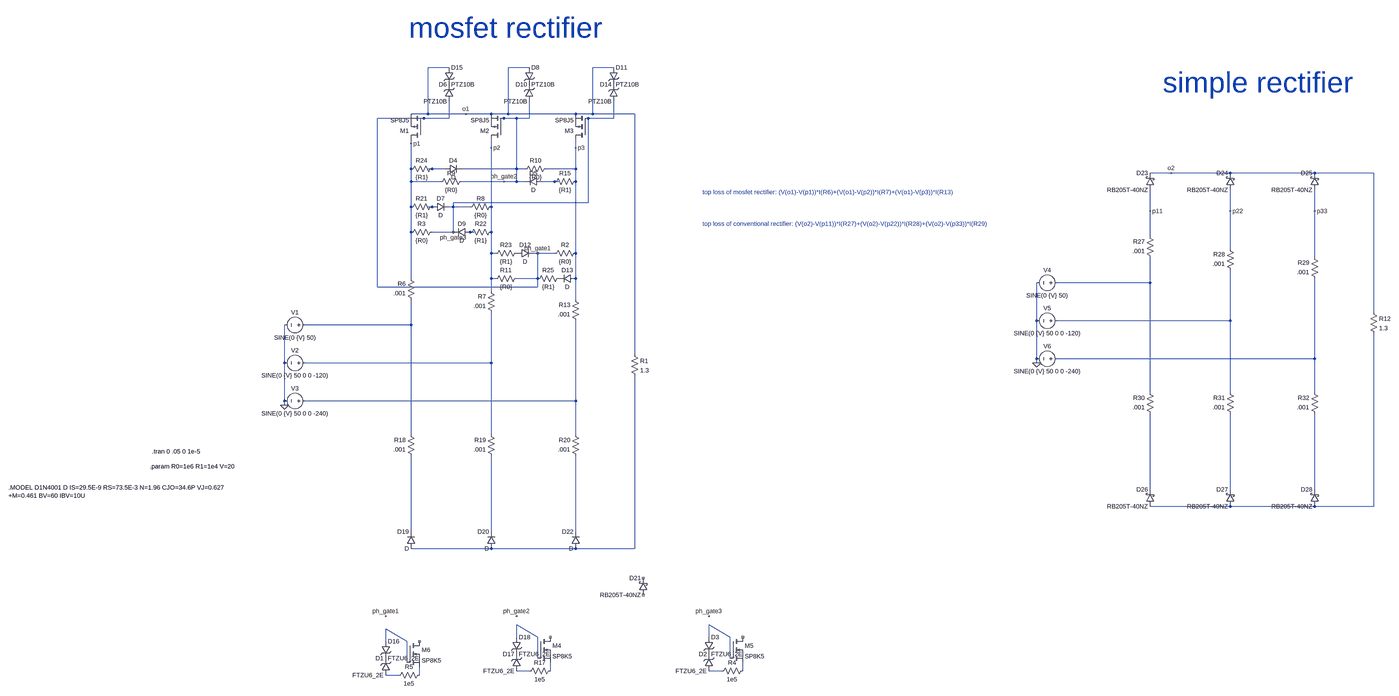
[diagram p0: schematic Draft1.asc, whole sheet]
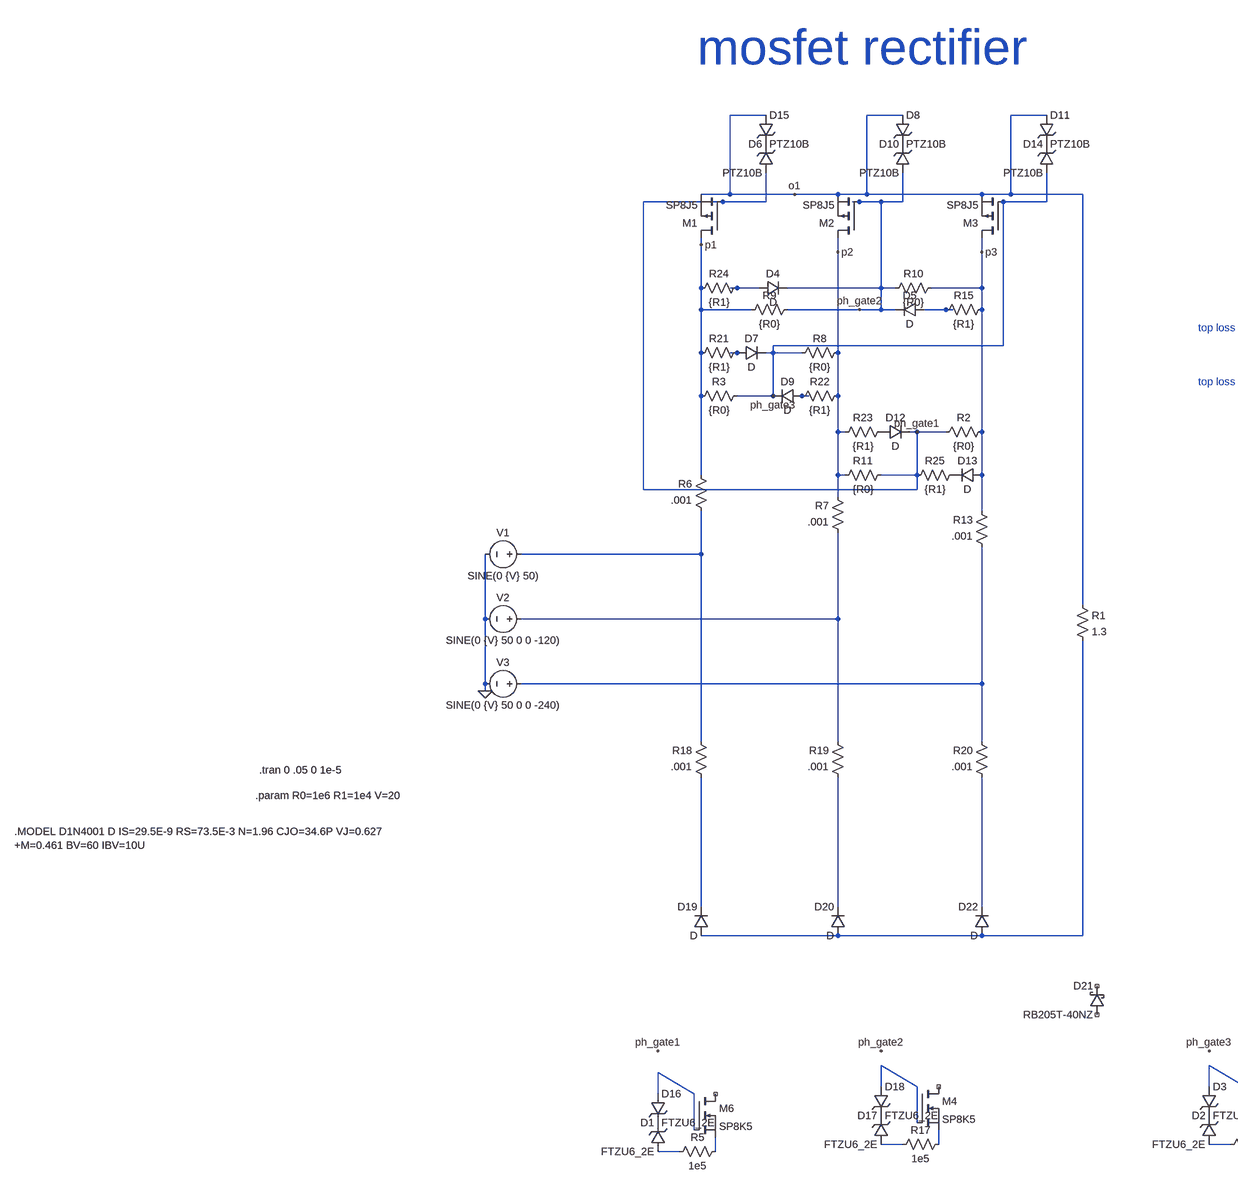
[diagram p1: schematic Draft1.asc, part, row 1 of 1, column 1 of 2]
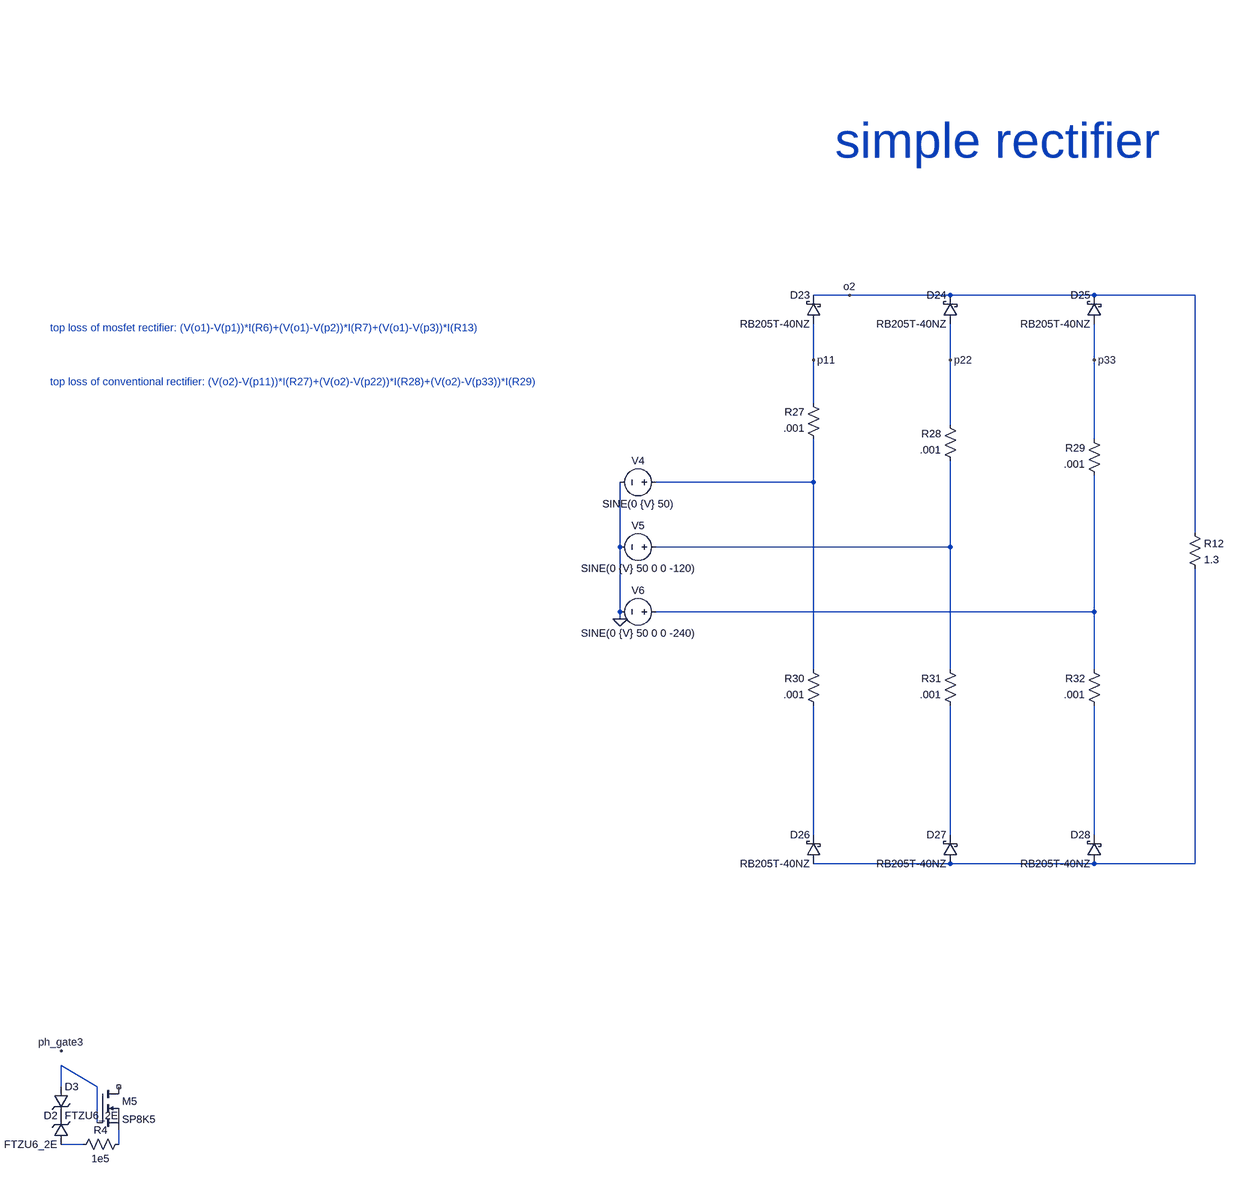
[diagram p2: schematic Draft1.asc, part, row 1 of 1, column 2 of 2]
Draft1.asc, the LTspice schematic file:
Version 4
SHEET 1 4840 1968
WIRE 608 -384 528 -384
WIRE 912 -384 832 -384
WIRE 1232 -384 1152 -384
WIRE 528 -208 528 -384
WIRE 528 -208 464 -208
WIRE 672 -208 528 -208
WIRE 768 -208 672 -208
WIRE 832 -208 832 -384
WIRE 832 -208 768 -208
WIRE 1088 -208 832 -208
WIRE 1152 -208 1152 -384
WIRE 1152 -208 1088 -208
WIRE 1312 -208 1152 -208
WIRE 512 -192 336 -192
WIRE 608 -192 608 -256
WIRE 608 -192 512 -192
WIRE 816 -192 800 -192
WIRE 864 -192 816 -192
WIRE 912 -192 912 -256
WIRE 912 -192 864 -192
WIRE 1232 -192 1232 -256
WIRE 1232 -192 1136 -192
WIRE 464 -96 464 -112
WIRE 768 -80 768 -112
WIRE 1088 -80 1088 -112
WIRE 464 0 464 -96
WIRE 544 0 528 0
WIRE 592 0 544 0
WIRE 864 0 864 -192
WIRE 864 0 656 0
WIRE 896 0 864 0
WIRE 1088 0 1088 -80
WIRE 1088 0 976 0
WIRE 3856 16 3776 16
WIRE 4080 16 3856 16
WIRE 4400 16 4080 16
WIRE 4624 16 4400 16
WIRE 464 48 464 0
WIRE 576 48 464 48
WIRE 816 48 656 48
WIRE 864 48 864 0
WIRE 864 48 816 48
WIRE 896 48 864 48
WIRE 1008 48 960 48
WIRE 1024 48 1008 48
WIRE 1088 48 1088 0
WIRE 1136 128 1136 -192
WIRE 1136 128 624 128
WIRE 464 144 464 48
WIRE 544 144 528 144
WIRE 624 144 624 128
WIRE 624 144 608 144
WIRE 688 144 624 144
WIRE 768 144 768 -80
WIRE 3776 160 3776 80
WIRE 4080 160 4080 80
WIRE 4400 160 4400 80
WIRE 464 240 464 144
WIRE 624 240 624 144
WIRE 624 240 544 240
WIRE 704 240 688 240
WIRE 768 240 768 144
WIRE 3776 256 3776 160
WIRE 4080 304 4080 160
WIRE 768 320 768 240
WIRE 784 320 768 320
WIRE 944 320 928 320
WIRE 1008 320 944 320
WIRE 1088 320 1088 48
WIRE 4400 336 4400 160
WIRE 464 416 464 240
WIRE 768 416 768 320
WIRE 784 416 768 416
WIRE 944 416 944 320
WIRE 944 416 864 416
WIRE 1088 416 1088 320
WIRE 3776 432 3776 336
WIRE 3776 432 3376 432
WIRE 336 448 336 -192
WIRE 944 448 944 416
WIRE 944 448 336 448
WIRE 768 464 768 416
WIRE 1088 496 1088 416
WIRE 4624 544 4624 16
WIRE 3296 576 3296 432
WIRE 4080 576 4080 384
WIRE 4080 576 3376 576
WIRE 464 592 464 496
WIRE 464 592 64 592
WIRE 1312 704 1312 -208
WIRE 3296 720 3296 576
WIRE 4400 720 4400 416
WIRE 4400 720 3376 720
WIRE -16 736 -16 592
WIRE 768 736 768 544
WIRE 768 736 64 736
WIRE 3296 736 3296 720
WIRE 3776 848 3776 432
WIRE 4080 848 4080 576
WIRE 4400 848 4400 720
WIRE -16 880 -16 736
WIRE 1088 880 1088 576
WIRE 1088 880 64 880
WIRE -16 896 -16 880
WIRE 464 1008 464 592
WIRE 768 1008 768 736
WIRE 1088 1008 1088 880
WIRE 3776 1216 3776 928
WIRE 4080 1216 4080 928
WIRE 4400 1216 4400 928
WIRE 4080 1280 3776 1280
WIRE 4400 1280 4080 1280
WIRE 4624 1280 4624 624
WIRE 4624 1280 4400 1280
WIRE 464 1376 464 1088
WIRE 768 1376 768 1088
WIRE 1088 1376 1088 1088
WIRE 768 1440 464 1440
WIRE 1088 1440 768 1440
WIRE 1312 1440 1312 784
WIRE 1312 1440 1088 1440
WIRE 864 1776 864 1728
WIRE 944 1776 864 1728
WIRE 1680 1776 1680 1728
WIRE 1760 1776 1680 1728
WIRE 368 1792 368 1744
WIRE 448 1792 368 1744
WIRE 944 1856 944 1776
WIRE 1760 1856 1760 1776
WIRE 448 1872 448 1792
WIRE 912 1904 864 1904
WIRE 992 1904 992 1872
WIRE 1728 1904 1680 1904
WIRE 1808 1904 1808 1872
WIRE 416 1920 368 1920
WIRE 496 1920 496 1888
FLAG -16 896 0
FLAG 864 1696 ph_gate2
FLAG 816 48 ph_gate2
FLAG 624 240 ph_gate3
FLAG 1680 1696 ph_gate3
FLAG 944 320 ph_gate1
FLAG 368 1696 ph_gate1
FLAG 3296 736 0
FLAG 672 -208 o1
FLAG 464 -96 p1
FLAG 768 -80 p2
FLAG 1088 -80 p3
FLAG 3856 16 o2
FLAG 3776 160 p11
FLAG 4080 160 p22
FLAG 4400 160 p33
SYMBOL voltage 80 592 R90
WINDOW 0 -32 56 VBottom 2
WINDOW 3 32 56 VTop 2
WINDOW 123 0 0 Left 0
WINDOW 39 0 0 Left 0
SYMATTR InstName V1
SYMATTR Value SINE(0 {V} 50)
SYMBOL voltage 80 736 R90
WINDOW 0 -32 56 VBottom 2
WINDOW 3 32 56 VTop 2
WINDOW 123 0 0 Left 0
WINDOW 39 0 0 Left 0
SYMATTR InstName V2
SYMATTR Value SINE(0 {V} 50 0 0 -120)
SYMBOL voltage 80 880 R90
WINDOW 0 -32 56 VBottom 2
WINDOW 3 32 56 VTop 2
WINDOW 123 0 0 Left 0
WINDOW 39 0 0 Left 0
SYMATTR InstName V3
SYMATTR Value SINE(0 {V} 50 0 0 -240)
SYMBOL pmos 512 -112 R180
SYMATTR InstName M1
SYMATTR Value SP8J5
SYMBOL res 1296 688 R0
SYMATTR InstName R1
SYMATTR Value 1.3
SYMBOL diode 592 16 R270
WINDOW 0 32 32 VTop 2
WINDOW 3 0 32 VBottom 2
SYMATTR InstName D4
SYMBOL diode 960 32 R90
WINDOW 0 0 32 VBottom 2
WINDOW 3 32 32 VTop 2
SYMATTR InstName D5
SYMBOL diode 544 160 R270
WINDOW 0 32 32 VTop 2
WINDOW 3 0 32 VBottom 2
SYMATTR InstName D7
SYMBOL diode 688 224 R90
WINDOW 0 0 32 VBottom 2
WINDOW 3 32 32 VTop 2
SYMATTR InstName D9
SYMBOL diode 864 336 R270
WINDOW 0 32 32 VTop 2
WINDOW 3 0 32 VBottom 2
SYMATTR InstName D12
SYMBOL diode 1088 400 R90
WINDOW 0 0 32 VBottom 2
WINDOW 3 32 32 VTop 2
SYMATTR InstName D13
SYMBOL res 880 400 R90
WINDOW 0 0 56 VBottom 2
WINDOW 3 32 56 VTop 2
SYMATTR InstName R11
SYMATTR Value {R0}
SYMBOL res 480 512 R180
WINDOW 0 36 76 Left 2
WINDOW 3 36 40 Left 2
SYMATTR InstName R6
SYMATTR Value .001
SYMBOL res 784 560 R180
WINDOW 0 36 76 Left 2
WINDOW 3 36 40 Left 2
SYMATTR InstName R7
SYMATTR Value .001
SYMBOL res 1104 592 R180
WINDOW 0 36 76 Left 2
WINDOW 3 36 40 Left 2
SYMATTR InstName R13
SYMATTR Value .001
SYMBOL zener 880 1904 R180
WINDOW 0 24 64 Left 2
WINDOW 3 24 0 Left 2
SYMATTR InstName D17
SYMATTR Value FTZU6_2E
SYMATTR Description Diode
SYMATTR Type diode
SYMBOL zener 848 1776 R0
SYMATTR InstName D18
SYMATTR Value FTZU6_2E
SYMATTR Description Diode
SYMATTR Type diode
SYMBOL res 1008 1888 R90
WINDOW 0 0 56 VBottom 2
WINDOW 3 32 56 VTop 2
SYMATTR InstName R17
SYMATTR Value 1e5
SYMBOL zener 1696 1904 R180
WINDOW 0 24 64 Left 2
WINDOW 3 24 0 Left 2
SYMATTR InstName D2
SYMATTR Value FTZU6_2E
SYMATTR Description Diode
SYMATTR Type diode
SYMBOL zener 1664 1776 R0
SYMATTR InstName D3
SYMATTR Value FTZU6_2E
SYMATTR Description Diode
SYMATTR Type diode
SYMBOL res 1824 1888 R90
WINDOW 0 0 56 VBottom 2
WINDOW 3 32 56 VTop 2
SYMATTR InstName R4
SYMATTR Value 1e5
SYMBOL nmos 448 1792 R0
SYMATTR InstName M6
SYMATTR Value SP8K5
SYMBOL zener 384 1920 R180
WINDOW 0 24 64 Left 2
WINDOW 3 24 0 Left 2
SYMATTR InstName D1
SYMATTR Value FTZU6_2E
SYMATTR Description Diode
SYMATTR Type diode
SYMBOL zener 352 1792 R0
SYMATTR InstName D16
SYMATTR Value FTZU6_2E
SYMATTR Description Diode
SYMATTR Type diode
SYMBOL res 512 1904 R90
WINDOW 0 0 56 VBottom 2
WINDOW 3 32 56 VTop 2
SYMATTR InstName R5
SYMATTR Value 1e5
SYMBOL nmos 944 1776 R0
SYMATTR InstName M4
SYMATTR Value SP8K5
SYMBOL nmos 1760 1776 R0
SYMATTR InstName M5
SYMATTR Value SP8K5
SYMBOL res 480 1104 R180
WINDOW 0 36 76 Left 2
WINDOW 3 36 40 Left 2
SYMATTR InstName R18
SYMATTR Value .001
SYMBOL res 784 1104 R180
WINDOW 0 36 76 Left 2
WINDOW 3 36 40 Left 2
SYMATTR InstName R19
SYMATTR Value .001
SYMBOL res 1104 1104 R180
WINDOW 0 36 76 Left 2
WINDOW 3 36 40 Left 2
SYMATTR InstName R20
SYMATTR Value .001
SYMBOL diode 480 1440 R180
WINDOW 0 24 64 Left 2
WINDOW 3 24 0 Left 2
SYMATTR InstName D19
SYMBOL diode 784 1440 R180
WINDOW 0 24 64 Left 2
WINDOW 3 24 0 Left 2
SYMATTR InstName D20
SYMBOL schottky 1360 1616 R180
WINDOW 0 24 64 Left 2
WINDOW 3 24 0 Left 2
SYMATTR InstName D21
SYMATTR Value RB205T-40NZ
SYMATTR Description Diode
SYMATTR Type diode
SYMBOL res 560 -16 R90
WINDOW 0 0 56 VBottom 2
WINDOW 3 32 56 VTop 2
SYMATTR InstName R24
SYMATTR Value {R1}
SYMBOL res 1104 304 R90
WINDOW 0 0 56 VBottom 2
WINDOW 3 32 56 VTop 2
SYMATTR InstName R2
SYMATTR Value {R0}
SYMBOL res 560 224 R90
WINDOW 0 0 56 VBottom 2
WINDOW 3 32 56 VTop 2
SYMATTR InstName R3
SYMATTR Value {R0}
SYMBOL res 784 128 R90
WINDOW 0 0 56 VBottom 2
WINDOW 3 32 56 VTop 2
SYMATTR InstName R8
SYMATTR Value {R0}
SYMBOL res 672 32 R90
WINDOW 0 0 56 VBottom 2
WINDOW 3 32 56 VTop 2
SYMATTR InstName R9
SYMATTR Value {R0}
SYMBOL res 992 -16 R90
WINDOW 0 0 56 VBottom 2
WINDOW 3 32 56 VTop 2
SYMATTR InstName R10
SYMATTR Value {R0}
SYMBOL res 1104 32 R90
WINDOW 0 0 56 VBottom 2
WINDOW 3 32 56 VTop 2
SYMATTR InstName R15
SYMATTR Value {R1}
SYMBOL res 560 128 R90
WINDOW 0 0 56 VBottom 2
WINDOW 3 32 56 VTop 2
SYMATTR InstName R21
SYMATTR Value {R1}
SYMBOL res 784 224 R90
WINDOW 0 0 56 VBottom 2
WINDOW 3 32 56 VTop 2
SYMATTR InstName R22
SYMATTR Value {R1}
SYMBOL res 880 304 R90
WINDOW 0 0 56 VBottom 2
WINDOW 3 32 56 VTop 2
SYMATTR InstName R23
SYMATTR Value {R1}
SYMBOL res 1040 400 R90
WINDOW 0 0 56 VBottom 2
WINDOW 3 32 56 VTop 2
SYMATTR InstName R25
SYMATTR Value {R1}
SYMBOL diode 1104 1440 R180
WINDOW 0 24 64 Left 2
WINDOW 3 24 0 Left 2
SYMATTR InstName D22
SYMBOL voltage 3392 432 R90
WINDOW 0 -32 56 VBottom 2
WINDOW 3 32 56 VTop 2
WINDOW 123 0 0 Left 0
WINDOW 39 0 0 Left 0
SYMATTR InstName V4
SYMATTR Value SINE(0 {V} 50)
SYMBOL voltage 3392 576 R90
WINDOW 0 -32 56 VBottom 2
WINDOW 3 32 56 VTop 2
WINDOW 123 0 0 Left 0
WINDOW 39 0 0 Left 0
SYMATTR InstName V5
SYMATTR Value SINE(0 {V} 50 0 0 -120)
SYMBOL voltage 3392 720 R90
WINDOW 0 -32 56 VBottom 2
WINDOW 3 32 56 VTop 2
WINDOW 123 0 0 Left 0
WINDOW 39 0 0 Left 0
SYMATTR InstName V6
SYMATTR Value SINE(0 {V} 50 0 0 -240)
SYMBOL res 4608 528 R0
SYMATTR InstName R12
SYMATTR Value 1.3
SYMBOL res 3792 352 R180
WINDOW 0 36 76 Left 2
WINDOW 3 36 40 Left 2
SYMATTR InstName R27
SYMATTR Value .001
SYMBOL res 4096 400 R180
WINDOW 0 36 76 Left 2
WINDOW 3 36 40 Left 2
SYMATTR InstName R28
SYMATTR Value .001
SYMBOL res 4416 432 R180
WINDOW 0 36 76 Left 2
WINDOW 3 36 40 Left 2
SYMATTR InstName R29
SYMATTR Value .001
SYMBOL res 3792 944 R180
WINDOW 0 36 76 Left 2
WINDOW 3 36 40 Left 2
SYMATTR InstName R30
SYMATTR Value .001
SYMBOL res 4096 944 R180
WINDOW 0 36 76 Left 2
WINDOW 3 36 40 Left 2
SYMATTR InstName R31
SYMATTR Value .001
SYMBOL res 4416 944 R180
WINDOW 0 36 76 Left 2
WINDOW 3 36 40 Left 2
SYMATTR InstName R32
SYMATTR Value .001
SYMBOL schottky 3792 80 R180
WINDOW 0 24 64 Left 2
WINDOW 3 24 0 Left 2
SYMATTR InstName D23
SYMATTR Value RB205T-40NZ
SYMATTR Description Diode
SYMATTR Type diode
SYMBOL schottky 4096 80 R180
WINDOW 0 24 64 Left 2
WINDOW 3 24 0 Left 2
SYMATTR InstName D24
SYMATTR Value RB205T-40NZ
SYMATTR Description Diode
SYMATTR Type diode
SYMBOL schottky 4416 80 R180
WINDOW 0 24 64 Left 2
WINDOW 3 24 0 Left 2
SYMATTR InstName D25
SYMATTR Value RB205T-40NZ
SYMATTR Description Diode
SYMATTR Type diode
SYMBOL schottky 3792 1280 R180
WINDOW 0 24 64 Left 2
WINDOW 3 24 0 Left 2
SYMATTR InstName D26
SYMATTR Value RB205T-40NZ
SYMATTR Description Diode
SYMATTR Type diode
SYMBOL schottky 4096 1280 R180
WINDOW 0 24 64 Left 2
WINDOW 3 24 0 Left 2
SYMATTR InstName D27
SYMATTR Value RB205T-40NZ
SYMATTR Description Diode
SYMATTR Type diode
SYMBOL schottky 4416 1280 R180
WINDOW 0 24 64 Left 2
WINDOW 3 24 0 Left 2
SYMATTR InstName D28
SYMATTR Value RB205T-40NZ
SYMATTR Description Diode
SYMATTR Type diode
SYMBOL pmos 816 -112 R180
SYMATTR InstName M2
SYMATTR Value SP8J5
SYMBOL pmos 1136 -112 R180
SYMATTR InstName M3
SYMATTR Value SP8J5
SYMBOL zener 592 -384 R0
SYMATTR InstName D15
SYMATTR Value PTZ10B
SYMATTR Description Diode
SYMATTR Type diode
SYMBOL zener 624 -256 R180
WINDOW 0 24 64 Left 2
WINDOW 3 24 0 Left 2
SYMATTR InstName D6
SYMATTR Value PTZ10B
SYMATTR Description Diode
SYMATTR Type diode
SYMBOL zener 896 -384 R0
SYMATTR InstName D8
SYMATTR Value PTZ10B
SYMATTR Description Diode
SYMATTR Type diode
SYMBOL zener 928 -256 R180
WINDOW 0 24 64 Left 2
WINDOW 3 24 0 Left 2
SYMATTR InstName D10
SYMATTR Value PTZ10B
SYMATTR Description Diode
SYMATTR Type diode
SYMBOL zener 1216 -384 R0
SYMATTR InstName D11
SYMATTR Value PTZ10B
SYMATTR Description Diode
SYMATTR Type diode
SYMBOL zener 1248 -256 R180
WINDOW 0 24 64 Left 2
WINDOW 3 24 0 Left 2
SYMATTR InstName D14
SYMATTR Value PTZ10B
SYMATTR Description Diode
SYMATTR Type diode
TEXT -712 1072 Left 2 !.tran 0 .05 0 1e-5
TEXT -720 1128 Left 2 !.param R0=1e6 R1=1e4 V=20
TEXT -1256 1208 Left 2 !.MODEL D1N4001 D IS=29.5E-9 RS=73.5E-3 N=1.96 CJO=34.6P VJ=0.627\n+M=0.461 BV=60 IBV=10U
TEXT 3824 -328 Left 7 ;simple rectifier
TEXT 456 -704 Left 7 ;mosfet rectifier
TEXT 1656 88 Left 2 ;top loss of mosfet rectifier: (V(o1)-V(p1))*I(R6)+(V(o1)-V(p2))*I(R7)+(V(o1)-V(p3))*I(R13)
TEXT 1656 208 Left 2 ;top loss of conventional rectifier: (V(o2)-V(p11))*I(R27)+(V(o2)-V(p22))*I(R28)+(V(o2)-V(p33))*I(R29)

The netlist it stands for:
* Draft1.asc
V1 N007 0 SINE(0 {V} 50)
V2 N009 0 SINE(0 {V} 50 0 0 -120)
V3 N010 0 SINE(0 {V} 50 0 0 -240)
M1 p1 ph_gate1 o1 o1 SP8J5
R1 o1 N018 1.3
D4 N001 ph_gate2 D
D5 N002 ph_gate2 D
D7 N003 ph_gate3 D
D9 N004 ph_gate3 D
D12 P001 ph_gate1 D
D13 p3 P002 D
R11 ph_gate1 p2 {R0}
R6 N007 p1 .001
R7 N009 p2 .001
R13 N010 p3 .001
D17 N022 P003 FTZU6_2E
D18 N019 P003 FTZU6_2E
R17 N023 N022 1e5
D2 N024 P004 FTZU6_2E
D3 N020 P004 FTZU6_2E
R4 N025 N024 1e5
M6 NC_01 N021 N027 N027 SP8K5
D1 N026 P005 FTZU6_2E
D16 N021 P005 FTZU6_2E
R5 N027 N026 1e5
M4 NC_02 N019 N023 N023 SP8K5
M5 NC_03 N020 N025 N025 SP8K5
R18 N015 N007 .001
R19 N016 N009 .001
R20 N017 N010 .001
D19 N018 N015 D
D20 N018 N016 D
D21 NC_04 NC_05 RB205T-40NZ
R24 N001 p1 {R1}
R2 p3 ph_gate1 {R0}
R3 ph_gate3 p1 {R0}
R8 p2 ph_gate3 {R0}
R9 ph_gate2 p1 {R0}
R10 p3 ph_gate2 {R0}
R15 p3 N002 {R1}
R21 N003 p1 {R1}
R22 p2 N004 {R1}
R23 P001 p2 {R1}
R25 P002 ph_gate1 {R1}
D22 N018 N017 D
V4 N005 0 SINE(0 {V} 50)
V5 N006 0 SINE(0 {V} 50 0 0 -120)
V6 N008 0 SINE(0 {V} 50 0 0 -240)
R12 o2 N014 1.3
R27 N005 p11 .001
R28 N006 p22 .001
R29 N008 p33 .001
R30 N011 N005 .001
R31 N012 N006 .001
R32 N013 N008 .001
D23 p11 o2 RB205T-40NZ
D24 p22 o2 RB205T-40NZ
D25 p33 o2 RB205T-40NZ
D26 N014 N011 RB205T-40NZ
D27 N014 N012 RB205T-40NZ
D28 N014 N013 RB205T-40NZ
M2 p2 ph_gate2 o1 o1 SP8J5
M3 p3 ph_gate3 o1 o1 SP8J5
D15 o1 P006 PTZ10B
D6 ph_gate1 P006 PTZ10B
D8 o1 P007 PTZ10B
D10 ph_gate2 P007 PTZ10B
D11 o1 P008 PTZ10B
D14 ph_gate3 P008 PTZ10B
.model D D
.lib standard.dio
.model NMOS NMOS
.model PMOS PMOS
.lib standard.mos
.tran 0 .05 0 1e-5
.param R0=1e6 R1=1e4 V=20
.MODEL D1N4001 D IS=29.5E-9 RS=73.5E-3 N=1.96 CJO=34.6P VJ=0.627
+M=0.461 BV=60 IBV=10U
* simple rectifier
* mosfet rectifier
* top loss of mosfet rectifier: (V(o1)-V(p1))*I(R6)+(V(o1)-V(p2))*I(R7)+(V(o1)-V(p3))*I(R13)
* top loss of conventional rectifier: (V(o2)-V(p11))*I(R27)+(V(o2)-V(p22))*I(R28)+(V(o2)-V(p33))*I(R29)
.backanno
.end